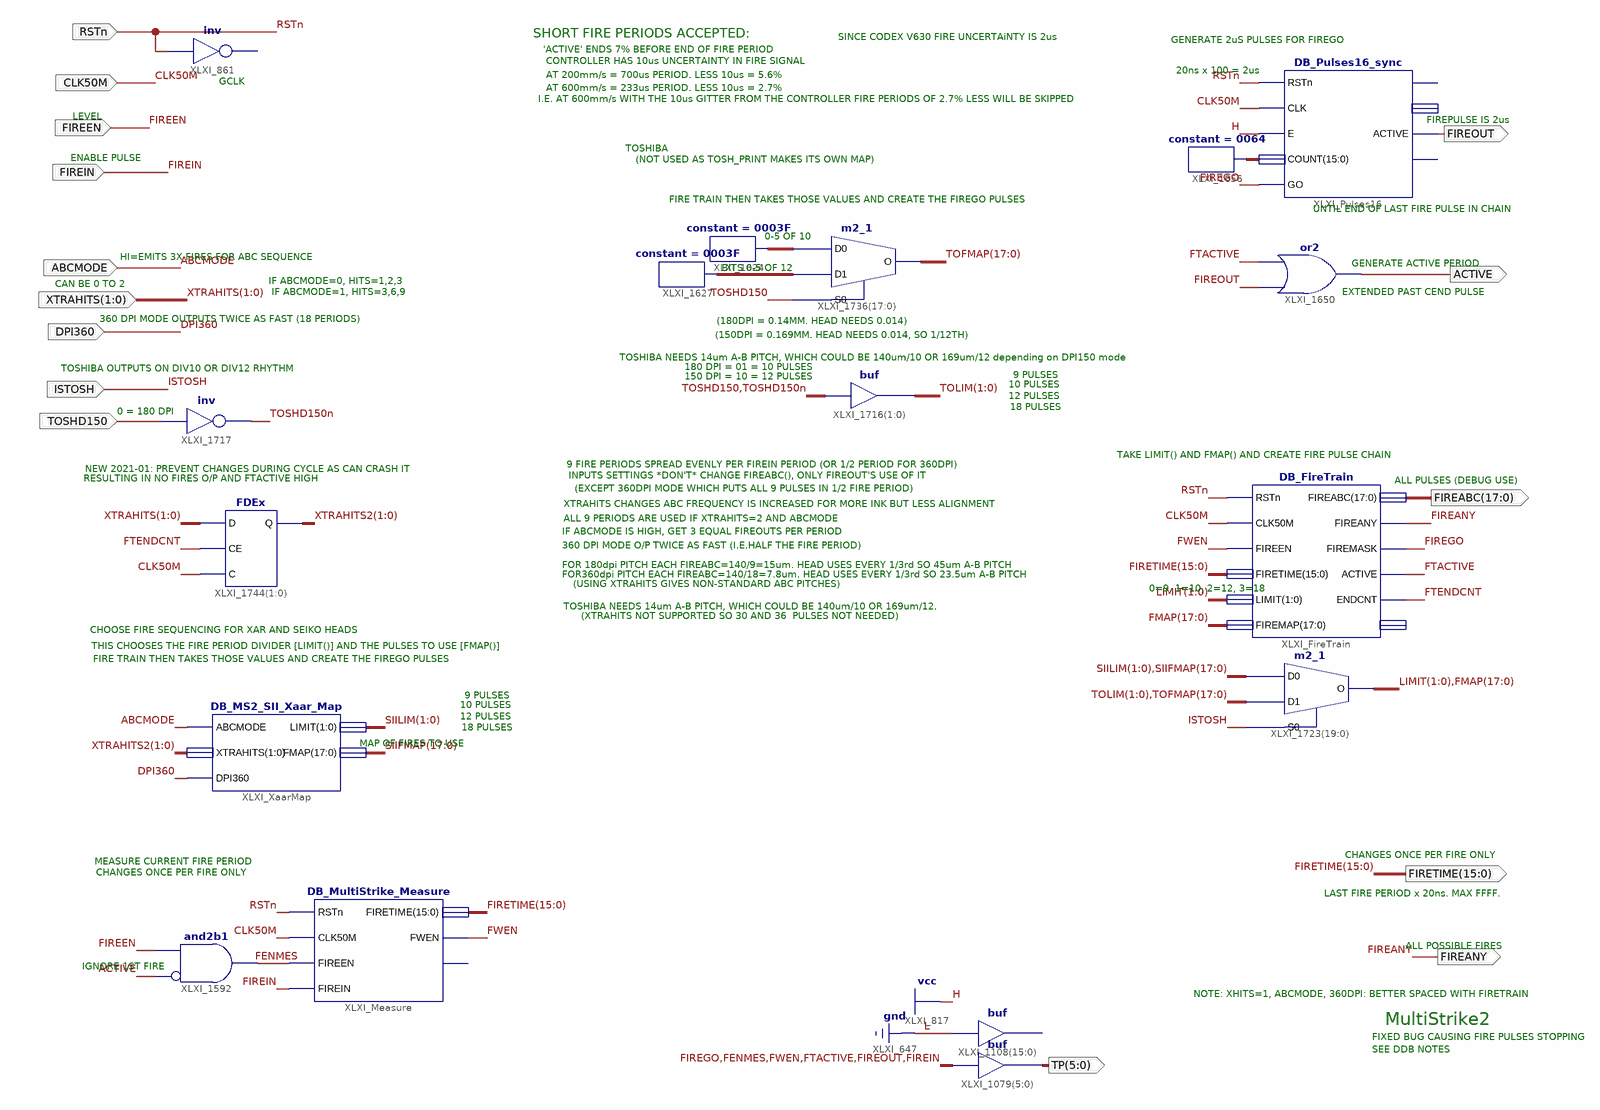
[diagram p0: schematic sheet 1]
// Xilinx ISE schematic DB_MultiStrike2.sch (spartan3e) as structural Verilog: 17 symbols, 15 ports
module DB_MultiStrike2 (
  input  RSTn,
  input  CLK50M,
  input  ABCMODE,
  input  FIREIN,
  input  DPI360,
  input  FIREEN,
  input  [1:0] XTRAHITS,
  input  ISTOSH,
  input  TOSHD150,
  output [15:0] FIRETIME,
  output ACTIVE,
  output FIREOUT,
  output [17:0] FIREABC,
  output FIREANY,
  output [5:0] TP
);

  wire FENMES, FIREGO, FTACTIVE, FTENDCNT, FWEN, TOSHD150n;
  wire [1:0] LIMIT, SIILIM, TOLIM, XTRAHITS2;
  wire [15:0] XLXN_2020;
  wire [17:0] FMAP, SIIFMAP, TOFMAP, XLXN_1935, XLXN_1959;

  // inv XLXI_861 has open pins: I=RSTn, O=open
  or XLXI_1650 (ACTIVE, FIREOUT, FTACTIVE);
  DB_Pulses16_sync XLXI_Pulses16 (
    .ACTIVE(FIREOUT), .CLK(CLK50M), .COUNT(XLXN_2020), .E(1'b1), .GO(FIREGO), .RSTn(RSTn));  // open: COUNTUP, PULSEOUT, TCNT
  constant #(.CValue("0064")) XLXI_1656 (.O(XLXN_2020));
  not XLXI_1717 (TOSHD150n, TOSHD150);
  m2_1 XLXI_1723[19:0] (.D0({SIILIM, SIIFMAP}), .D1({TOLIM, TOFMAP}), .S0(ISTOSH), .O({LIMIT, FMAP}));
  constant #(.CValue("0003F")) XLXI_1624 (.O(XLXN_1935));
  constant #(.CValue("0003F")) XLXI_1627 (.O(XLXN_1959));
  m2_1 XLXI_1736[17:0] (.D0(XLXN_1935), .D1(XLXN_1959), .S0(TOSHD150), .O(TOFMAP));
  assign TOLIM = {TOSHD150, TOSHD150n};  // buf XLXI_1716[1..0], 2 bits wide
  // buf XLXI_1108[15..0] has open pins: I=1'b0, O=open
  DB_FireTrain XLXI_FireTrain (
    .ACTIVE(FTACTIVE), .CLK50M(CLK50M), .ENDCNT(FTENDCNT), .FIREABC(FIREABC), .FIREANY(FIREANY),
    .FIREEN(FWEN), .FIREMAP(FMAP), .FIREMASK(FIREGO), .FIRETIME(FIRETIME), .LIMIT(LIMIT), .RSTn(RSTn));  // open: TP
  DB_MS2_SII_Xaar_Map XLXI_XaarMap (
    .ABCMODE(ABCMODE), .DPI360(DPI360), .FMAP(SIIFMAP), .LIMIT(SIILIM), .XTRAHITS(XTRAHITS2));
  and XLXI_1592 (FENMES, ~ACTIVE, FIREEN);  // and2b1
  DB_MultiStrike_Measure XLXI_Measure (
    .CLK50M(CLK50M), .FIREEN(FENMES), .FIREIN(FIREIN), .FIRETIME(FIRETIME), .FWEN(FWEN), .RSTn(RSTn));  // open: DONE1ST
  FDEx XLXI_1744[1:0] (.C(CLK50M), .CE(FTENDCNT), .D(XTRAHITS), .Q(XTRAHITS2));
  assign TP = {FIREGO, FENMES, FWEN, FTACTIVE, FIREOUT, FIREIN};  // buf XLXI_1079[5..0], 6 bits wide

  // Notes on the sheet:
  //   SHORT FIRE PERIODS ACCEPTED:
  //   SINCE CODEX V630 FIRE UNCERTAiNTY IS 2us
  //   GENERATE 2uS PULSES FOR FIREGO
  //   'ACTIVE' ENDS 7% BEFORE END OF FIRE PERIOD
  //   CONTROLLER HAS 10us UNCERTAINTY IN FIRE SIGNAL
  //   20ns x 100 = 2us
  //   AT 200mm/s = 700us PERIOD. LESS 10us = 5.6%
  //   GCLK
  //   AT 600mm/s = 233us PERIOD. LESS 10us = 2.7%
  //   I.E. AT 600mm/s WITH THE 10us GITTER FROM THE CONTROLLER FIRE PERIODS OF 2.7% LESS WILL BE SKIPPED
  //   LEVEL
  //   FIREPULSE IS 2us
  //   TOSHIBA
  //   ENABLE PULSE
  //   (NOT USED AS TOSH_PRINT MAKES ITS OWN MAP)
  //   FIRE TRAIN THEN TAKES THOSE VALUES AND CREATE THE FIREGO PULSES
  //   UNTIL END OF LAST FIRE PULSE IN CHAIN
  //   0-5 OF 10
  //   HI=EMITS 3X FIRES FOR ABC SEQUENCE
  //   GENERATE ACTIVE PERIOD
  //   BITS 0-5 OF 12
  //   IF ABCMODE=0, HITS=1,2,3
  //   CAN BE 0 TO 2
  //   IF ABCMODE=1, HITS=3,6,9
  //   EXTENDED PAST CEND PULSE
  //   360 DPI MODE OUTPUTS TWICE AS FAST (18 PERIODS)
  //   (180DPI = 0.14MM. HEAD NEEDS 0.014)
  //   (150DPI = 0.169MM. HEAD NEEDS 0.014, SO 1/12TH)
  //   TOSHIBA NEEDS 14um A-B PITCH, WHICH COULD BE 140um/10 OR 169um/12 depending on DPI150 mode
  //   180 DPI = 01 = 10 PULSES
  //   TOSHIBA OUTPUTS ON DIV10 OR DIV12 RHYTHM
  //   9 PULSES
  //   150 DPI = 10 = 12 PULSES
  //   10 PULSES
  //   12 PULSES
  //   18 PULSES
  //   0 = 180 DPI
  //   TAKE LIMIT() AND FMAP() AND CREATE FIRE PULSE CHAIN
  //   9 FIRE PERIODS SPREAD EVENLY PER FIREIN PERIOD (OR 1/2 PERIOD FOR 360DPI)
  //   NEW 2021-01: PREVENT CHANGES DURING CYCLE AS CAN CRASH IT
  //   INPUTS SETTINGS *DON'T* CHANGE FIREABC(), ONLY FIREOUT'S USE OF IT
  //   RESULTING IN NO FIRES O/P AND FTACTIVE HIGH
  //   ALL PULSES (DEBUG USE)
  //   (EXCEPT 360DPI MODE WHICH PUTS ALL 9 PULSES IN 1/2 FIRE PERIOD)
  //   XTRAHITS CHANGES ABC FREQUENCY IS INCREASED FOR MORE INK BUT LESS ALIGNMENT
  //   ALL 9 PERIODS ARE USED IF XTRAHITS=2 AND ABCMODE
  //   IF ABCMODE IS HIGH, GET 3 EQUAL FIREOUTS PER PERIOD
  //   360 DPI MODE O/P TWICE AS FAST (I.E.HALF THE FIRE PERIOD)
  //   FOR 180dpi PITCH EACH FIREABC=140/9=15um. HEAD USES EVERY 1/3rd SO 45um A-B PITCH
  //   FOR360dpi PITCH EACH FIREABC=140/18=7.8um. HEAD USES EVERY 1/3rd SO 23.5um A-B PITCH
  //   (USING XTRAHITS GIVES NON-STANDARD ABC PITCHES)
  //   0=9, 1=10, 2=12, 3=18
  //   TOSHIBA NEEDS 14um A-B PITCH, WHICH COULD BE 140um/10 OR 169um/12.
  //   (XTRAHITS NOT SUPPORTED SO 30 AND 36  PULSES NOT NEEDED)
  //   CHOOSE FIRE SEQUENCING FOR XAR AND SEIKO HEADS
  //   THIS CHOOSES THE FIRE PERIOD DIVIDER [LIMIT()] AND THE PULSES TO USE [FMAP()]
  //   FIRE TRAIN THEN TAKES THOSE VALUES AND CREATE THE FIREGO PULSES
  //   9 PULSES
  //   10 PULSES
  //   12 PULSES
  //   18 PULSES
  //   MAP OF FIRES TO USE
  //   CHANGES ONCE PER FIRE ONLY
  //   MEASURE CURRENT FIRE PERIOD
  //   CHANGES ONCE PER FIRE ONLY
  //   LAST FIRE PERIOD x 20ns. MAX FFFF.
  //   ALL POSSIBLE FIRES
  //   IGNORE 1ST FIRE
  //   NOTE: XHITS=1, ABCMODE, 360DPI: BETTER SPACED WITH FIRETRAIN
  //   MultiStrike2
  //   FIXED BUG CAUSING FIRE PULSES STOPPING
  //   SEE DDB NOTES
endmodule
